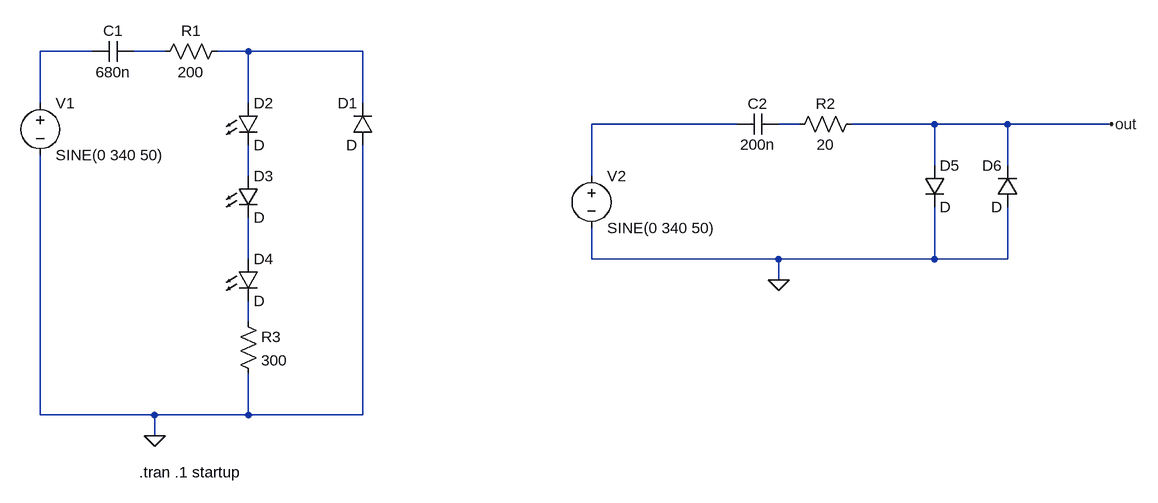
[diagram p0: schematic Led-Secteur.asc]
Led-Secteur.asc, the LTspice schematic file:
Version 4
SHEET 1 1720 760
WIRE 96 96 16 96
WIRE 208 96 160 96
WIRE 336 96 288 96
WIRE 512 96 336 96
WIRE 16 176 16 96
WIRE 336 176 336 96
WIRE 512 176 512 96
WIRE 1088 208 864 208
WIRE 1184 208 1152 208
WIRE 1392 208 1264 208
WIRE 1504 208 1392 208
WIRE 1664 208 1504 208
WIRE 1392 272 1392 208
WIRE 1504 272 1504 208
WIRE 336 288 336 240
WIRE 864 288 864 208
WIRE 336 416 336 352
WIRE 864 416 864 368
WIRE 1152 416 864 416
WIRE 1392 416 1392 336
WIRE 1392 416 1152 416
WIRE 1504 416 1504 336
WIRE 1504 416 1392 416
WIRE 1152 448 1152 416
WIRE 336 512 336 480
WIRE 16 656 16 256
WIRE 192 656 16 656
WIRE 336 656 336 592
WIRE 336 656 192 656
WIRE 512 656 512 240
WIRE 512 656 336 656
WIRE 192 688 192 656
FLAG 192 688 0
FLAG 1152 448 0
FLAG 1664 208 out
SYMBOL voltage 16 160 R0
WINDOW 123 0 0 Left 0
WINDOW 39 0 0 Left 0
SYMATTR InstName V1
SYMATTR Value SINE(0 340 50)
SYMBOL res 304 80 R90
WINDOW 0 0 56 VBottom 2
WINDOW 3 32 56 VTop 2
SYMATTR InstName R1
SYMATTR Value 200
SYMBOL diode 528 240 R180
WINDOW 0 24 64 Left 2
WINDOW 3 24 0 Left 2
SYMATTR InstName D1
SYMBOL LED 320 176 R0
SYMATTR InstName D2
SYMBOL cap 160 80 R90
WINDOW 0 0 32 VBottom 2
WINDOW 3 32 32 VTop 2
SYMATTR InstName C1
SYMATTR Value 680n
SYMBOL LED 320 288 R0
SYMATTR InstName D3
SYMBOL LED 320 416 R0
SYMATTR InstName D4
SYMBOL voltage 864 272 R0
WINDOW 123 0 0 Left 0
WINDOW 39 0 0 Left 0
SYMATTR InstName V2
SYMATTR Value SINE(0 340 50)
SYMBOL cap 1152 192 R90
WINDOW 0 0 32 VBottom 2
WINDOW 3 32 32 VTop 2
SYMATTR InstName C2
SYMATTR Value 200n
SYMBOL res 1280 192 R90
WINDOW 0 0 56 VBottom 2
WINDOW 3 32 56 VTop 2
SYMATTR InstName R2
SYMATTR Value 20
SYMBOL diode 1376 272 R0
SYMATTR InstName D5
SYMBOL diode 1520 336 R180
WINDOW 0 24 64 Left 2
WINDOW 3 24 0 Left 2
SYMATTR InstName D6
SYMBOL res 320 496 R0
SYMATTR InstName R3
SYMATTR Value 300
TEXT 168 744 Left 2 !.tran .1 startup

The netlist it stands for:
* Led-Secteur.asc
V1 N001 0 SINE(0 340 50)
R1 N003 N002 200
D1 0 N003 D
D2 N003 N006 D
C1 N002 N001 680n
D3 N006 N007 D
D4 N007 N008 D
V2 N004 0 SINE(0 340 50)
C2 N005 N004 200n
R2 out N005 20
D5 out 0 D
D6 0 out D
R3 N008 0 300
.model D D
.lib standard.dio
.tran .1 startup
.backanno
.end